# Altium schematic sheet super cap2.SchDoc
size 342 x 191 mm
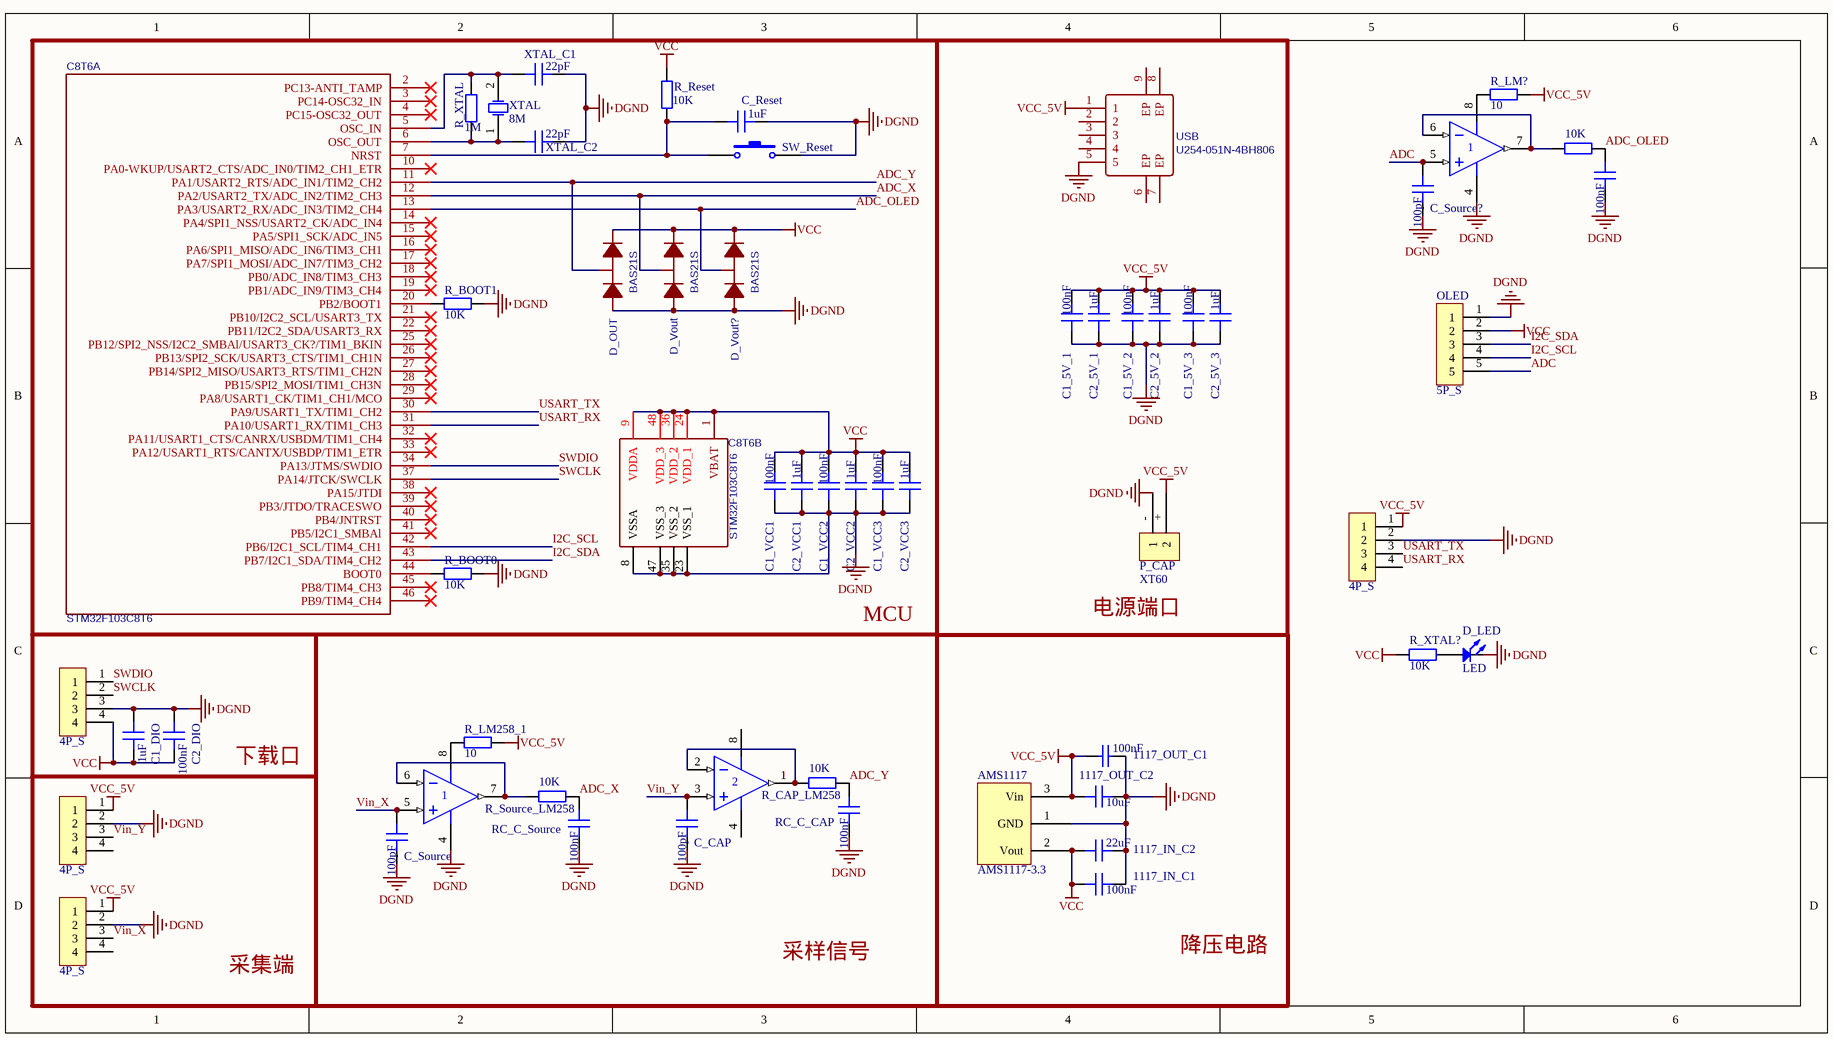
[diagram p0: super cap2.SchDoc]

## Parts
1117_IN_C1  100nF  [LC-0603_C]
1117_IN_C2  22uF  [LC-1206_C]
1117_OUT_C1  100nF  [LC-0603_C]
1117_OUT_C2  10uF  [C0805_2]
AMS1117  AMS1117-3.3  [LC-SOT-223]
C1_5V_1  100nF  [LC-0603_C]
C1_5V_2  100nF  [LC-0603_C]
C1_5V_3  100nF  [LC-0603_C]
C1_DIO  1uF  [LC-0603_C]
C1_VCC1  100nF  [LC-0603_C]
C1_VCC2  100nF  [LC-0603_C]
C1_VCC3  100nF  [LC-0603_C]
C2_5V_1  1uF  [LC-0603_C]
C2_5V_2  1uF  [LC-0603_C]
C2_5V_3  1uF  [LC-0603_C]
C2_DIO  100nF  [LC-0603_C]
C2_VCC1  1uF  [LC-0603_C]
C2_VCC2  1uF  [LC-0603_C]
C2_VCC3  1uF  [LC-0603_C]
C8T6  STM32F103C8T6  [LQFP-48_7X7X05P]  (parts A,B of 2)
C_CAP  100pF  [LC-0603_C]
C_Reset  1uF  [LC-0603_C]
C_Source  100pF  [LC-0603_C]
C_Source?  100pF  [LC-0603_C]
D_LED  LED  [LC-0603_LED_S1]
D_OUT  BAS21S  [SOT-23(SOT-23-3)]
D_Vout  BAS21S  [SOT-23(SOT-23-3)]
D_Vout?  BAS21S  [SOT-23(SOT-23-3)]
FLASH  4P_S  [A1251WR-S-4P]
FLASH?  4P_S  [排针_4P]
LM258_1  LM258D  [SOIC-8_150mil]  (value not drawn)  (parts A,B of 2)
LM?  LM258D  [SOIC-8_150mil]  (value not drawn)  (part A of 2)
OLED  5P_S  [排针1*5]
P_CAP  XT60  [XT30_卧式_公头]
R_BOOT0  value 10K  [LC-0603_R]  (hidden comment: 220)
R_BOOT1  value 10K  [LC-0603_R]  (hidden comment: 220)
R_CAP_LM258  10K  [LC-0603_R]
R_LM258_1  value 10  [LC-0603_R]  (hidden comment: 220)
R_LM?  value 10  [LC-0603_R]  (hidden comment: 220)
R_Reset  value 10K  [LC-0603_R]  (hidden comment: 220)
R_Source_LM258  10K  [LC-0603_R]
R_Source_LM?  10K  [LC-0603_R]
R_XTAL  value 1M  [LC-0603_R]  (hidden comment: 220)
R_XTAL?  10K  [LC-0603_R]
RC_C_CAP  100nF  [LC-0603_C]
RC_C_Source  100nF  [LC-0603_C]
RC_C_Source?  100nF  [LC-0603_C]
SW_Reset  SW  [SW]  (value not drawn)
USB  U254-051N-4BH806  [U254-051N-4BH806]
X  4P_S  [XH2.54-4P]
XTAL  8M  [HC-49S]
XTAL_C1  22pF  [LC-0603_C]
XTAL_C2  22pF  [LC-0603_C]
Y  4P_S  [XH2.54-4P]

## Nets
DGND: 1117_IN_C1.1 1117_IN_C2.1 1117_OUT_C1.1 1117_OUT_C2.1 AMS1117.1(GND) C1_5V_1.2 C1_5V_2.2 C1_5V_3.2 C1_DIO.1 C1_VCC1.2 C1_VCC2.2 C1_VCC3.2 C2_5V_1.2 C2_5V_2.2 C2_5V_3.2 C2_DIO.1 C2_VCC1.2 C2_VCC2.2 C2_VCC3.2 C8T6.8(VSSA) C8T6.23(VSS_1) C8T6.35(VSS_2) C8T6.47(VSS_3) C_CAP.2 C_Reset.1 C_Source.2 C_Source?.2 D_LED.1(K) D_OUT.1 D_Vout.1 D_Vout?.1 FLASH.3 FLASH?.2 LM258_1.4(V-) LM?.4(V-) OLED.1 P_CAP.-(1) R_BOOT0.1 R_BOOT1.1 RC_C_CAP.2 RC_C_Source.2 RC_C_Source?.2 SW_Reset.2 USB.5 X.2 XTAL_C1.1 XTAL_C2.1 Y.2
VCC: 1117_IN_C1.2 1117_IN_C2.2 AMS1117.2(Vout) C1_DIO.2 C1_VCC1.1 C1_VCC2.1 C1_VCC3.1 C2_DIO.2 C2_VCC1.1 C2_VCC2.1 C2_VCC3.1 C8T6.1(VBAT) C8T6.9(VDDA) C8T6.24(VDD_1) C8T6.36(VDD_2) C8T6.48(VDD_3) D_OUT.2 D_Vout.2 D_Vout?.2 FLASH.4 OLED.2 R_Reset.1 R_XTAL?.1
VCC_5V: 1117_OUT_C1.2 1117_OUT_C2.2 AMS1117.3(Vin) C1_5V_1.1 C1_5V_2.1 C1_5V_3.1 C2_5V_1.1 C2_5V_2.1 C2_5V_3.1 FLASH?.1 P_CAP.+(2) R_LM258_1.1 R_LM?.1 USB.1 X.1 Y.1
ADC: C_Source?.1 LM?.5(IN+) OLED.5
ADC_OLED: C8T6.13(PA3/USART2_RX/ADC_IN3/TIM2_CH4) D_Vout?.3 R_Source_LM?.2 RC_C_Source?.1
ADC_X: C8T6.12(PA2/USART2_TX/ADC_IN2/TIM2_CH3) D_Vout.3 R_Source_LM258.2 RC_C_Source.1
ADC_Y: C8T6.11(PA1/USART2_RTS/ADC_IN1/TIM2_CH2) D_OUT.3 R_CAP_LM258.2 RC_C_CAP.1
I2C_SCL: C8T6.42(PB6/I2C1_SCL/TIM4_CH1) OLED.4
I2C_SDA: C8T6.43(PB7/I2C1_SDA/TIM4_CH2) OLED.3
SWCLK: C8T6.37(PA14/JTCK/SWCLK) FLASH.2
SWDIO: C8T6.34(PA13/JTMS/SWDIO) FLASH.1
USART_RX: C8T6.31(PA10/USART1_RX/TIM1_CH3) FLASH?.4
USART_TX: C8T6.30(PA9/USART1_TX/TIM1_CH2) FLASH?.3
Vin_X: C_Source.1 LM258_1.5(IN+) X.3
Vin_Y: C_CAP.1 LM258_1.3(IN+) Y.3
NetC8T6_5: C8T6.5(OSC_IN) R_XTAL.1 XTAL.2(OSC2) XTAL_C1.2
NetC8T6_6: C8T6.6(OSC_OUT) R_XTAL.2 XTAL.1(OSC1) XTAL_C2.2
NetC8T6_7: C8T6.7(NRST) C_Reset.2 R_Reset.2 SW_Reset.1
NetC8T6_20: C8T6.20(PB2/BOOT1) R_BOOT1.2
NetC8T6_44: C8T6.44(BOOT0) R_BOOT0.2
NetD_LED_2: D_LED.2(A) R_XTAL?.2
NetLM258_1_1: LM258_1.1(OUT) LM258_1.2(IN-) R_CAP_LM258.1
NetLM258_1_6: LM258_1.6(IN-) LM258_1.7(OUT) R_Source_LM258.1
NetLM258_1_8: LM258_1.8(V+) R_LM258_1.2
NetLM?_6: LM?.6(IN-) LM?.7(OUT) R_Source_LM?.1
NetLM?_8: LM?.8(V+) R_LM?.2

Not connected (* = marked no-connect by the designer): C8T6 2(PC13-ANTI_TAMP)* 3(PC14-OSC32_IN)* 4(PC15-OSC32_OUT)* 10(PA0-WKUP/USART2_CTS/ADC_IN0/TIM2_CH1_ETR)* 14(PA4/SPI1_NSS/USART2_CK/ADC_IN4)* 15(PA5/SPI1_SCK/ADC_IN5)* 16(PA6/SPI1_MISO/ADC_IN6/TIM3_CH1)* 17(PA7/SPI1_MOSI/ADC_IN7/TIM3_CH2)* 18(PB0/ADC_IN8/TIM3_CH3)* 19(PB1/ADC_IN9/TIM3_CH4)* 21(PB10/I2C2_SCL/USART3_TX)* 22(PB11/I2C2_SDA/USART3_RX)* 25(PB12/SPI2_NSS/I2C2_SMBAl/USART3_CK?/TIM1_BKIN)* 26(PB13/SPI2_SCK/USART3_CTS/TIM1_CH1N)* 27(PB14/SPI2_MISO/USART3_RTS/TIM1_CH2N)* 28(PB15/SPI2_MOSI/TIM1_CH3N)* 29(PA8/USART1_CK/TIM1_CH1/MCO)* 32(PA11/USART1_CTS/CANRX/USBDM/TIM1_CH4)* 33(PA12/USART1_RTS/CANTX/USBDP/TIM1_ETR)* 38(PA15/JTDI)* 39(PB3/JTDO/TRACESWO)* 40(PB4/JNTRST)* 41(PB5/I2C1_SMBAl)* 45(PB8/TIM4_CH3)* 46(PB9/TIM4_CH4)*; USB 2 3 4 6(EP) 7(EP) 8(EP) 9(EP); X 4; Y 4

## Notes on the sheet
- MCU
- 电源端口
- 下载口
- 采集端
- 采样信号
- 降压电路

## Library data of the parts
1117_IN_C1 1117_IN_C2 1117_OUT_C2 C1_5V_1-C1_5V_3 C1_VCC1-C1_VCC3 C2_5V_1-C2_5V_3 C2_VCC1-C2_VCC3 C_CAP C_Reset C_Source C_Source? RC_C_CAP RC_C_Source RC_C_Source? XTAL_C1 XTAL_C2 = C1608X7R1E104K080AA: CAP CER 0.1UF 25V X7R 0603; Manufacturer: TDK Corporation; TemperatureRange: -55C ~ 125C; Tolerance: 10%; Value: 0.1uF; Part Number: C1608X7R1E104K080AA; PartId: 4029; Supplier 1: Digi-Key; Supplier Part Number 1: 445-1316-1-ND; ComponentLink1Description: Datasheet; ComponentLink1URL: https://product.tdk.com/info/en/catalog/datasheets/mlcc_commercial_general_en.pdf; ComponentLink2Description: Digi-Key listing; ComponentLink2URL: http://digikey.com/product-detail/en/C1608X7R1E104K080AA/445-1316-1-ND/567697; TemperatureCoefficient: X7R; Voltage: 25V; Price: 0.14; Type: -; Device Package: 0603 (1608 Metric)
1117_OUT_C1 = 0603 1.5nF (152) 10% 50V: 贴片电容; ComponentLink1Description: 供应商链接; ComponentLink1URL: http://www.szlcsc.com/product/details_1947.html; Package: 0603; Supplier: LC; SuppliersPartNumber: C1595
C1_DIO C2_DIO = C1608X5R0J226M080AC: CAP CER 22UF 6.3V X5R 0603; Manufacturer: TDK Corporation; TemperatureRange: -55C ~ 85C; Tolerance: 20%; Value: 22uF; Part Number: C1608X5R0J226M080AC; PartId: 12992; Supplier 1: Digi-Key; Supplier Part Number 1: 445-8028-2-ND; ComponentLink1Description: Datasheet; ComponentLink1URL: https://product.tdk.com/info/en/catalog/datasheets/mlcc_commercial_general_en.pdf; ComponentLink2Description: Digi-Key Listing; ComponentLink2URL: https://www.digikey.com/product-detail/en/tdk-corporation/C1608X5R0J226M080AC/445-8028-2-ND/2792254; TemperatureCoefficient: X5R; Voltage: 6.3V; Price: 0.0816; Device Package: 0603 (1608 Metric)
C8T6 = STM32F103C8T6: BOM_Manufacturer: ST; subpart_no: 2; tags: STM32; timeStamp: 1455028086; BOM_Supplier Part: C8734; BOM_Supplier: LCSC; BOM_Manufacturer Part: STM32F103C8T6; image: http://image.lceda.cn/szlcsc/C8734.jpg; spicePre: U
D_OUT D_Vout D_Vout? = BAS21S: BOM_Manufacturer: CJ; BOM_Supplier: LCSC; BOM_Manufacturer Part: BAS21S; BOM_Supplier Part: C68966; BOM_LCSC Assembly: Yes; spicePre: D
P_CAP = XT60PW
R_BOOT0 R_BOOT1 R_LM258_1 R_LM? R_Reset R_XTAL R_XTAL? = Res2: Resistor; Published: 8-Jun-2000; LatestRevisionDate: 17-Jul-2002; LatestRevisionNote: Re-released for DXP Platform.; PackageReference: 0805R; Publisher: Altium Limited
  R_XTAL?: Value: 10K
R_CAP_LM258 R_Source_LM258 R_Source_LM? = 0603 5.1Ω (5R10) 1%: 贴片电阻; ComponentLink1Description: 供应商链接; ComponentLink1URL: http://www.szlcsc.com/product/details_25940.html; Package: 0603; Supplier: LC; SuppliersPartNumber: C25197
USB = U254-051N-4BH806: BOM_Manufacturer: XKB Enterprise; Contributor: LCSC; BOM_Supplier: LCSC; BOM_Supplier Part: C319170; BOM_Manufacturer Part: U254-051N-4BH806; spicePre: U
XTAL = XTAL